# EAGLE design efm8ub1-kalypso-mezzanine-usb-interface-v1 (EAGLE 7.7.0)
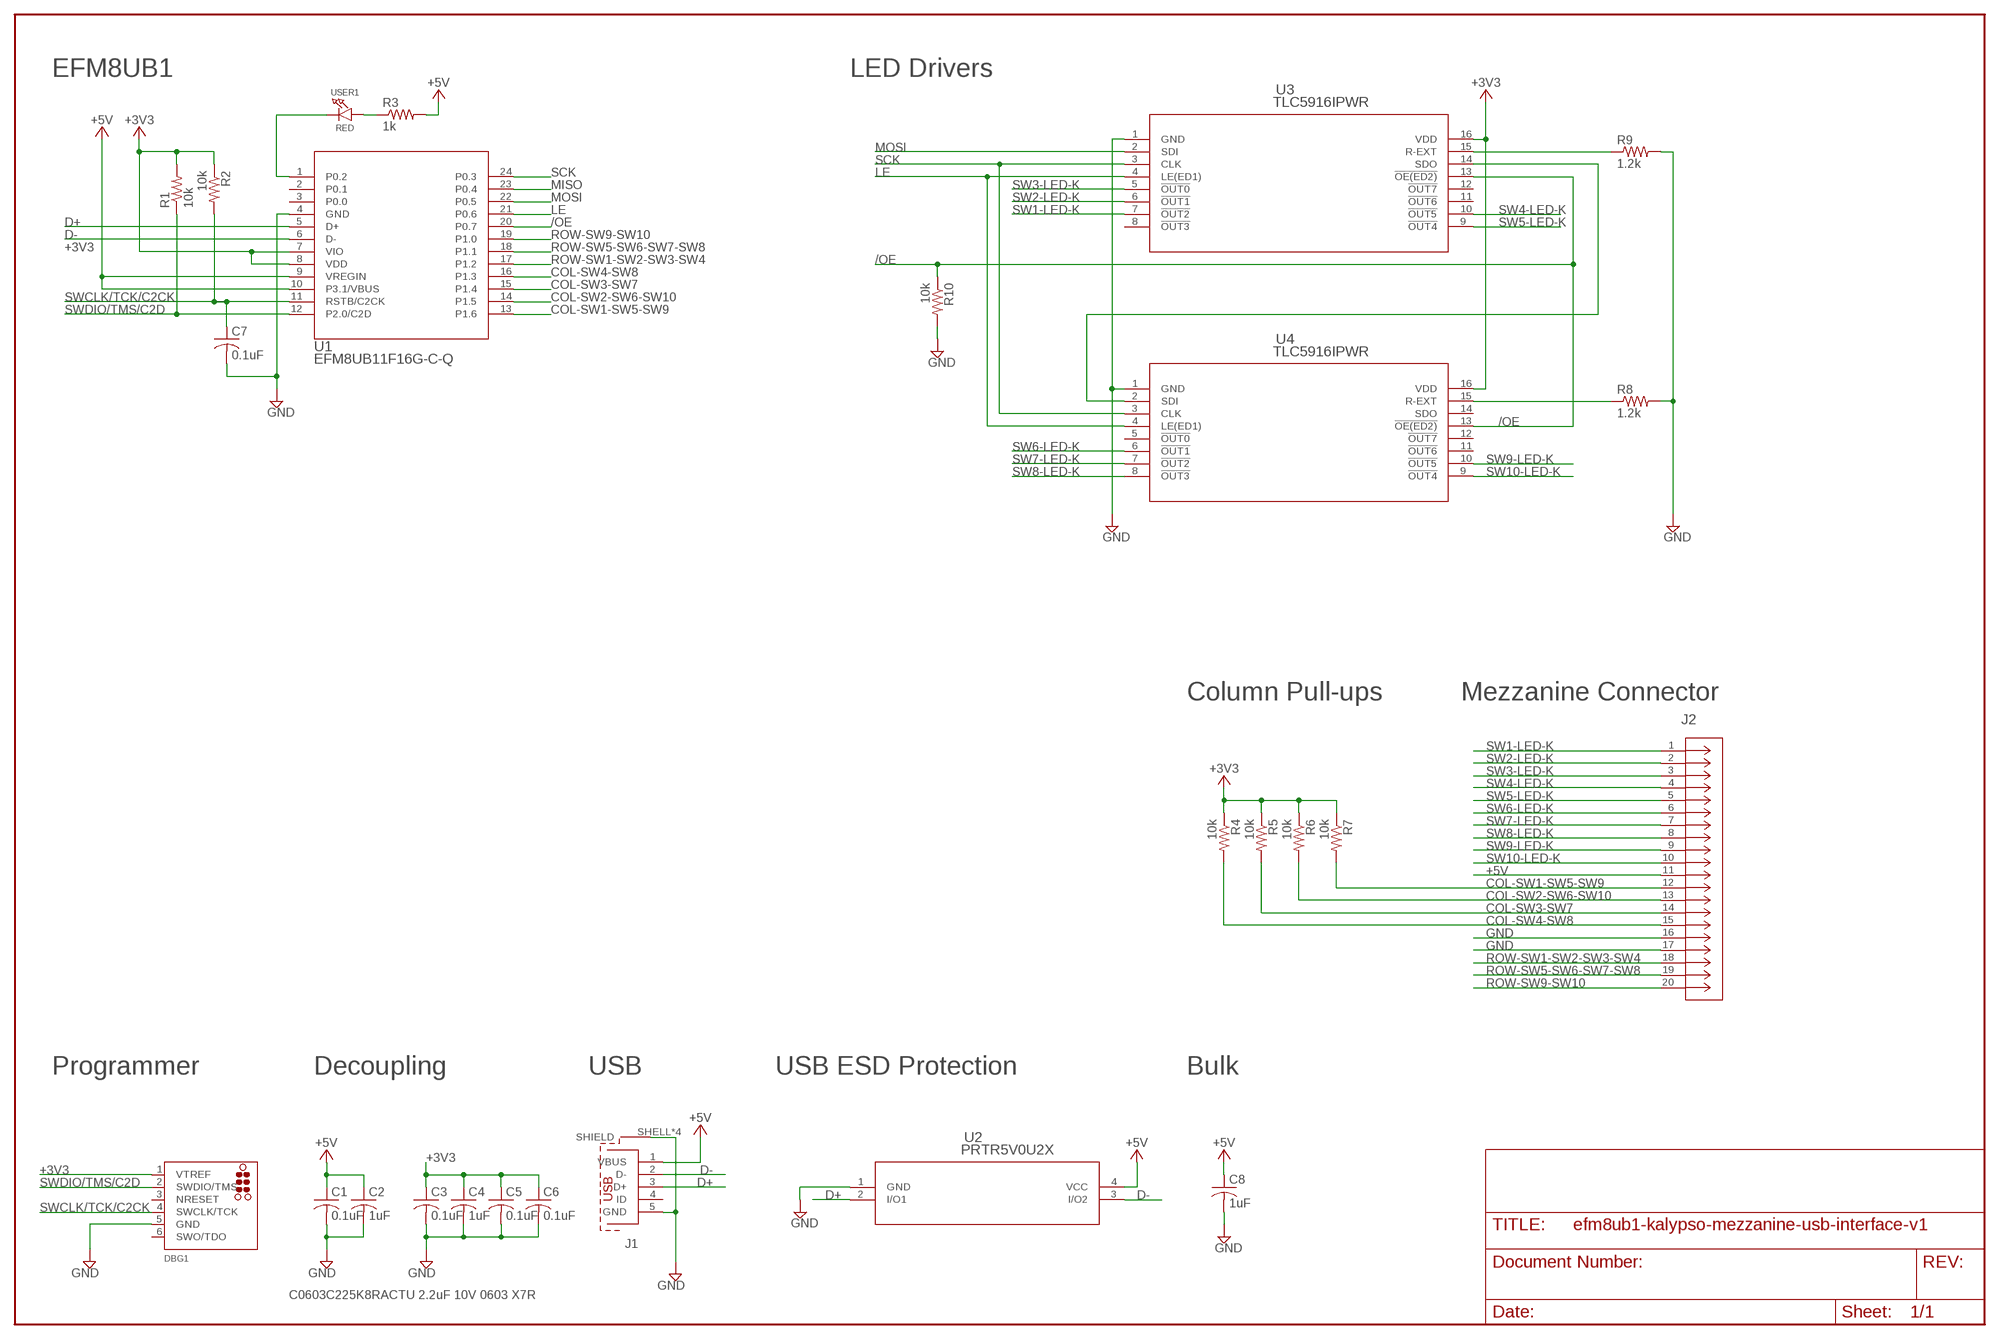
[diagram p0: schematic, sheet 1]

## Parts
C1  0.1uF  C-USC0603  [C0603]
C2  1uF  C-USC0603  [C0603]
C3  0.1uF  C-USC0603  [C0603]
C4  1uF  C-USC0603  [C0603]
C5  0.1uF  C-USC0603  [C0603]
C6  0.1uF  C-USC0603  [C0603]
C7  0.1uF  C-USC0603  [C0603]
C8  1uF  C-USC1210  [C1210]
DBG1  TC2030-CTX-SWD  [TC2030-MCP-NL]
J1  629105136821  [629105136821]
J2  SLW20S-1C7LF  [CON20_1X20_UB_58JF_GLE]
R1  10k  R-US_R0603  [R0603]
R2  10k  R-US_R0603  [R0603]
R3  1k  R-US_R0603  [R0603]
R4  10k  R-US_R0603  [R0603]
R5  10k  R-US_R0603  [R0603]
R6  10k  R-US_R0603  [R0603]
R7  10k  R-US_R0603  [R0603]
R8  1.2k  R-US_R0603  [R0603]
R9  1.2k  R-US_R0603  [R0603]
R10  10k  R-US_R0603  [R0603]
U1  EFM8UB11F16G-C-Q  [QSOP24]
U2  PRTR5V0U2X  [SOT143B]
U3  TLC5916IPWR  [PW16_TEX]
U4  TLC5916IPWR  [PW16_TEX]
USER1  RED  LED0805_NOOUTLINE  [CHIPLED_0805_NOOUTLINE]

## Nets
+3V3: C3.1 C4.1 C5.1 C6.1 DBG1.1(VTREF) R1.2 R2.1 R4.1 R5.1 R6.1 R7.1 U1.7(VIO) U1.8(VDD) U3.16(VDD) U4.16(VDD)
+5V: C1.1 C2.1 C8.1 J1.1(VBUS) J2.11 R3.2 U1.9(VREGIN) U1.10(P3.1/VBUS) U2.4(VCC)
/OE: R10.1 U1.20(P0.7) U3.13(!OE(ED2)) U4.13(!OE(ED2))
COL-SW1-SW5-SW9: J2.12 R7.2 U1.13(P1.6)
COL-SW2-SW6-SW10: J2.13 R6.2 U1.14(P1.5)
COL-SW3-SW7: J2.14 R5.2 U1.15(P1.4)
COL-SW4-SW8: J2.15 R4.2 U1.16(P1.3)
D+: J1.3(D+) U1.5(D+) U2.2(I/O1)
D-: J1.2(D-) U1.6(D-) U2.3(I/O2)
GND: C1.2 C2.2 C3.2 C4.2 C5.2 C6.2 C7.2 C8.2 DBG1.5(GND) J1.5(GND) J1.SHELL1(SHIELD) J1.SHELL2(SHIELD) J1.SHELL3(SHIELD) J1.SHELL(SHIELD) J2.16 J2.17 R8.2 R9.2 R10.2 U1.4(GND) U2.1(GND) U3.1(GND) U4.1(GND)
LE: U1.21(P0.6) U3.4(LE(ED1)) U4.4(LE(ED1))
MISO: U1.23(P0.4)
MOSI: U1.22(P0.5) U3.2(SDI)
N$2: R3.1 USER1.A
N$3: U3.14(SDO) U4.2(SDI)
N$4: R8.1 U4.15(R-EXT)
N$5: R9.1 U3.15(R-EXT)
ROW-SW1-SW2-SW3-SW4: J2.18 U1.17(P1.2)
ROW-SW5-SW6-SW7-SW8: J2.19 U1.18(P1.1)
ROW-SW9-SW10: J2.20 U1.19(P1.0)
SCK: U1.24(P0.3) U3.3(CLK) U4.3(CLK)
SW1-LED-K: J2.1 U3.7(!OUT2)
SW2-LED-K: J2.2 U3.6(!OUT1)
SW3-LED-K: J2.3 U3.5(!OUT0)
SW4-LED-K: J2.4 U3.10(!OUT5)
SW5-LED-K: J2.5 U3.9(!OUT4)
SW6-LED-K: J2.6 U4.6(!OUT1)
SW7-LED-K: J2.7 U4.7(!OUT2)
SW8-LED-K: J2.8 U4.8(!OUT3)
SW9-LED-K: J2.9 U4.10(!OUT5)
SW10-LED-K: J2.10 U4.9(!OUT4)
SWCLK/TCK/C2CK: C7.1 DBG1.4(SWCLK/TCK) R2.2 U1.11(RSTB/C2CK)
SWDIO/TMS/C2D: DBG1.2(SWDIO/TMS) R1.1 U1.12(P2.0/C2D)
USER1: U1.1(P0.2) USER1.C
Unconnected: DBG1.6(SWO/TDO) J1.4(ID) U1.2(P0.1) U1.3(P0.0) U3.8(!OUT3) U3.11(!OUT6) U3.12(!OUT7) U4.5(!OUT0) U4.11(!OUT6) U4.12(!OUT7) U4.14(SDO)

## Notes on the sheet
- EFM8UB1 | LED Drivers
- Column Pull-ups | Mezzanine Connector
- Programmer | Decoupling | USB | USB ESD Protection | Bulk
- C0603C225K8RACTU 2.2uF 10V 0603 X7R

## Power pins joined to a net without a drawn wire
NRESET: DBG1.3(NRESET)

## Library data of the parts
C1-C8 = rcl:C-US: CAPACITOR, American symbol
DBG1 = tag-connect:TC2030-CTX-SWD
J1 = InputOutputIO (rev18a):629105136821: WR-COM SMT Horizontal 5 Contacts Micro USB Type B,5 pins=>Code : Con_I-O_COM_MicroUSB_629105136821 <http://katalog.we-online.de/media/images/eican/Con_I-O_COM_MicroUSB_629105136821_pf2.jpg> Details see: http://katalog.we-online.de/en/em/COM_MICRO_SMT_TYPE_B_HORIZONTAL/629105136821?m Created 2014-07-09, Karrer Zheng 2014 (C) Würth Elektronik
J2 = SLW20S-1C7LF:SLW20S-1C7LF; BUILT_BY: EMA_UL_Team; MANUFACTURER_PART_NUMBER: SLW20S-1C7LF; SOURCELIBRARY: Glenair_2008-01-01_3; VENDOR: FCI
R1-R10 = rcl:R-US_: RESISTOR, American symbol
U1 = EFM8UB11F16G-C-QSOP24:EFM8UB11F16G-C-Q; MANUFACTURER_PART_NUMBER: efm8ub11f16gbqsop24; VENDOR: Silicon Labs
U2 = Nexperia_PRTR5V0U2X,215:PRTR5V0U2X; MANUFACTURER_PART_NUMBER: PRTR5V0U2X; VENDOR: NXP
U3 U4 = ul_tlc5916:TLC5916IPWR; BUILT_BY: EMA_UL_Team; MANUFACTURER: Texas Instruments; MANUFACTURER_PART_NUMBER: TLC5916IPWR; SOURCELIBRARY: TI_2015-1-6; VENDOR: Texas Instruments
USER1 = microbuilder:LED: LED 0603 - 0603 Surface Mount Package 2mA: Green LED - Low Power (3.9mcd, 2ma, 1.7Vf) - Digikey: 475-2709-2-ND Orange LED - Low Power (9.8mcd, 2ma, 1.8Vf) - Digikey: 475-1194-2-ND Red LED - Low Power (5mcd, 2ma, 1.8Vf) - Digikey: 475-1195-2-ND Yellow LED - Low Power (7mcd, 2ma, 1.8Vf) - Digikey: 475-1196-2-ND 5mA: Blue LED - Low Power (17mcd, 5ma, 2.9Vf) - Digikey: LNJ937W8CRACT-ND 0805 - 0805 Surface Mount Package 2mA: Red LED (8.8mcd, 2mA, 1.8Vf, Clear) - Low Power [Digikey: 475-2510-1-ND] Green LED (5mcd, 2mA, 1.8Vf, Clear) - Low Power [Digikey: 475-2730-1-ND] Yellow LED (11.3mcd, 2mA, 1.8Vf, Clear) - Low Power [Digikey: 475-2555-1-ND] 20mA: Red LED (104mcd, 20mA, Diffused) - LS R976 [Digikey: 475-1278-6-ND] Red LED (12mcd, 20mA, 2.0Vf, Clear) - APT2012EC [Digikey: 754-1128-1-ND] Green LED (15mcd, 20mA, 2.2Vf, Clear) - APT2012GC [Digikey: 754-1131-1-ND] Orange LED (160mcd, 20mA, 2.1Vf, Clear) - APT2012SECK [Digikey: 754-1130-1-ND] 1206 - 1206 Surface Mount Package Green LED (26mcd, 20mA, Diffused) - LG N971 [Digikey: 475-1407-6-ND] Red LED (15mcd, 20mA, Diffused) - LH N974 [Digikey: 475-1416-6-ND] Cree - Cree High-Power Surface Mount LEDs XPEBWT-L1-0000-00D50 - White 111lm 350mA 2.9Vf 6200K 110° XTEAWT-00-0000-00000LEE3 - White 114lm 350mA 2.85Vf 5000K 115° Everlight - Everlight 45-21 Series Surface Mount LEDs 45-21/QK2C-B2832AC2CB2/2T - Warm White 2000mcd 20mA 3.25Vf 3050K 120° 45-21/LK2C-B38452C4CB2/2T - Nuetral White 2000mcd 20mA 3.25Vf 4150K 120° 45-21/LK2C-B50634C6CB2/2T - Cold White 2200mcd 20mA 3.25Vf 5650K 120° PLCC2 Reverse Mount LS T77K-J1L2-1-0-2-R18-Z - Red 11.25mcd 2mA 1.8Vf 630nm 120° LO T77K-L1M2-24-Z - Orange 19.6mcd 2mA 1.8Vf 606nm 120° LY T77K-K2M1-26-Z - Yellow 15.7mcd 2mA 1.8Vf 587nm 120°

## Board
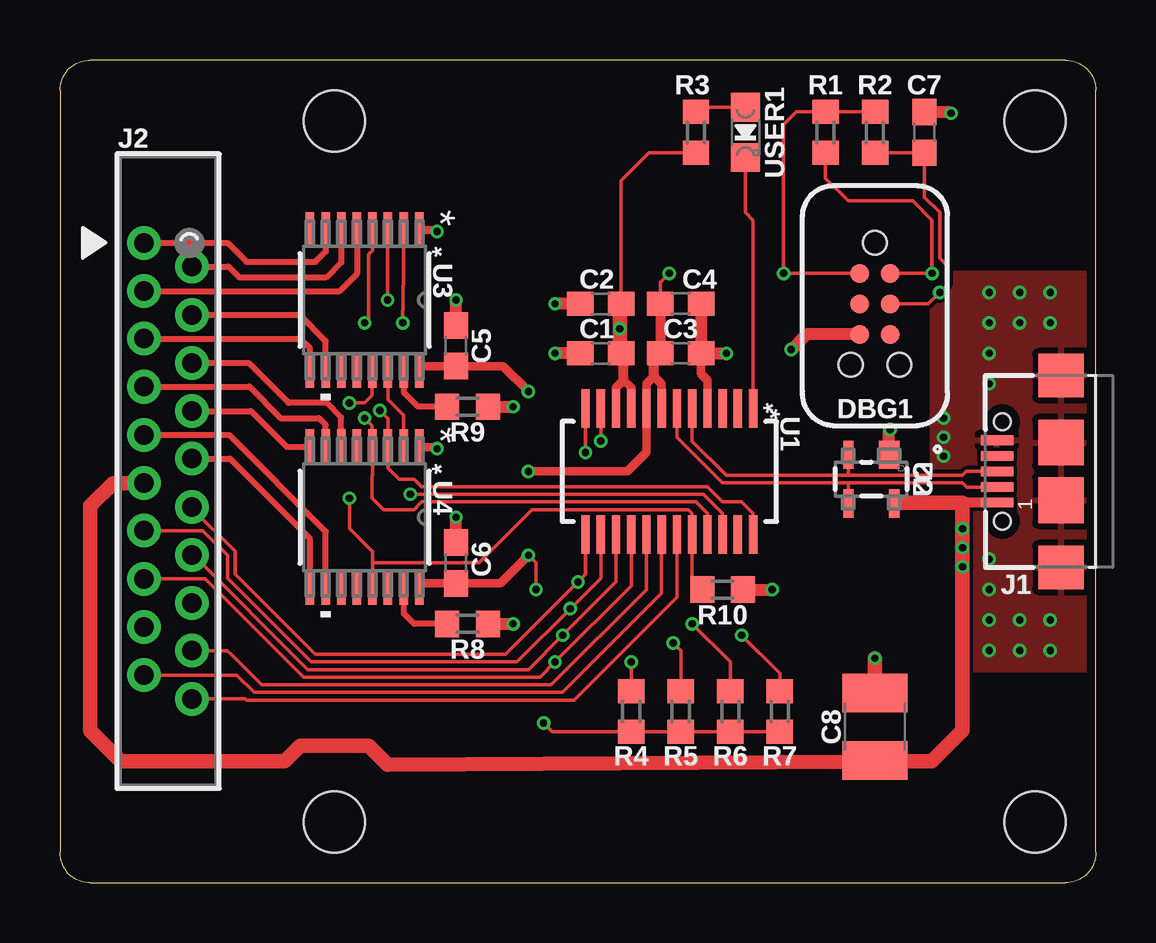
[diagram p1: board, top side]
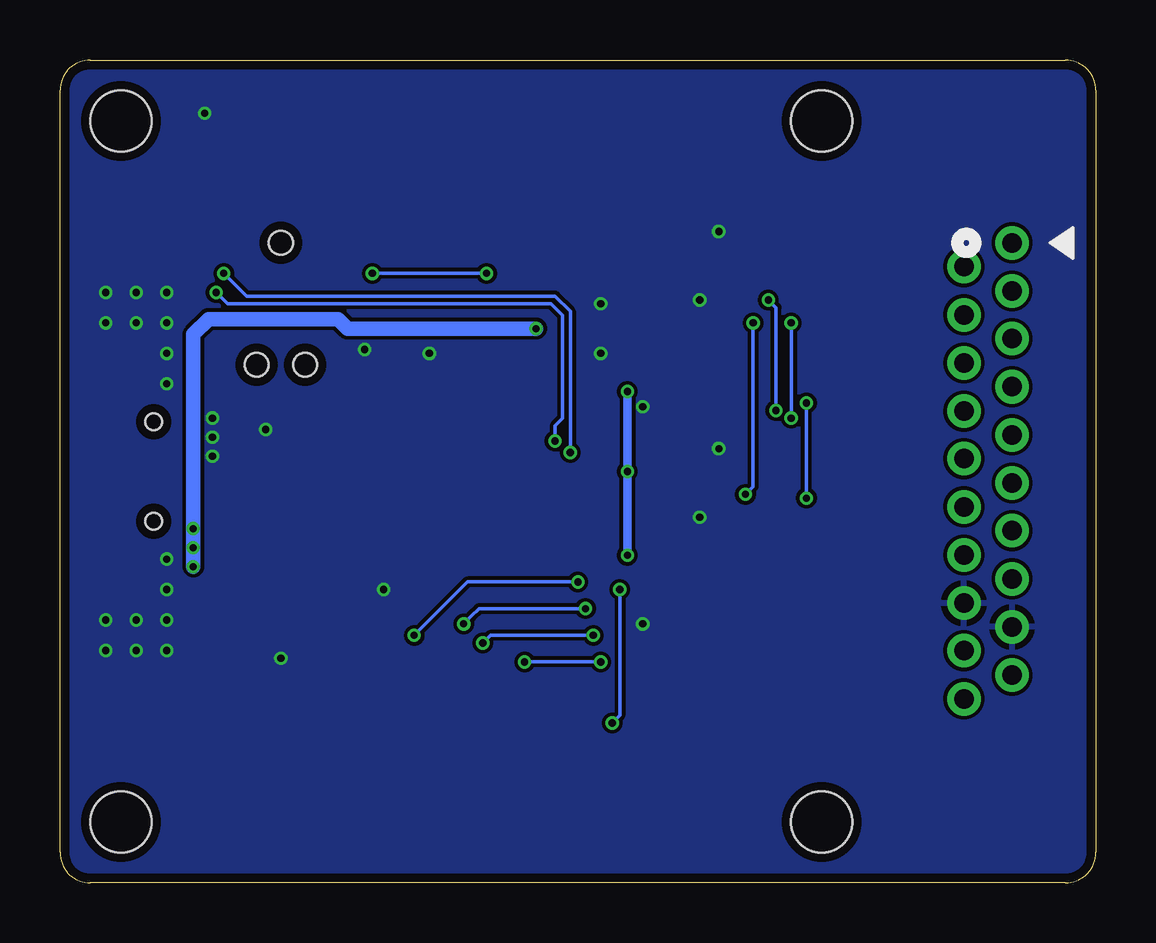
[diagram p2: board, bottom side, seen from below]

Size 43.18 x 34.29 mm. Coordinates in mm from the lower left corner, seen from the top.
Outline: 1.27,0 41.91,0 arc90 43.18,1.27 43.18,33.02 arc90 41.91,34.29 1.27,34.29 arc90 0,33.02 0,1.27 arc90 1.27,0
Copper layers (1*16): Top 0.035559375mm / dielectric 1.6mm / Bottom 0.035559375mm
Design rules "oshpark-2layer-2018": minimum track width 6mil, minimum drill 10mil, track to track 6mil, track to pad 6mil, pad to pad 6mil, via to via 6mil, smd to smd 6mil, copper to edge 15mil, drill to drill 6mil, minimum pad ring 5mil, minimum via ring 5mil, stop-mask expansion 2.5mil, vias tented up to drill 0mil, thermal gap 10mil
Holes 2.54 mm at 11.43,31.75 40.64,31.75 40.64,2.54 11.43,2.54
tKeepout: area 8.9,29.8 to 13.4,34.3; area 8.9,0 to 13.4,4.5; area 38.7,0 to 43.2,4.5; area 38.7,29.8 to 43.2,34.3
bKeepout: area 38.1,29.2 to 43.2,34.3; area 38.1,0 to 43.2,5.1; area 8.9,0 to 14,5.1; area 8.9,29.2 to 14,34.3; area 8.6,29 to 14.2,34.5; area 37.8,29 to 43.4,34.5; area 37.8,-0.3 to 43.4,5.3; area 8.6,-0.3 to 14.2,5.3

### Footprints (pad centres in the part's own frame; a part is rotated, then mirrored left to right if it is on the bottom)
C0603 = smd 1.1 x 1: 1 -0.85,0; 2 0.85,0
C1210 = smd 1.6 x 2.7: 1 -1.4,0; 2 1.4,0
TC2030-MCP-NL = smd 0.787 x 0.787: 1 1.27,-0.635; 2 1.27,0.635; 3 2.54,-0.635; 4 2.54,0.635; 5 3.81,-0.635; 6 3.81,0.635 | hole 0.991: 0,0; 5.08,-1.016; 5.08,1.016
629105136821 = smd 0.4 x 1.35: 1 -1.3,2.675; 2 -0.65,2.675; 3 0,2.675; 4 0.65,2.675; 5 1.3,2.675 | smd 1.8 x 1.9: SHELL -4,0; SHELL3 4,0 | smd 1.9 x 1.9: SHELL1 -1.2,0; SHELL2 1.2,0 | hole 0.7: -2.075,2.45; 2.075,2.45
CON20_1X20_UB_58JF_GLE = drill 0.813 pad 1.397: 1 0,0; 2 0.991,2.007; 3 2.007,0; 4 2.997,2.007; 5 3.988,0; 6 5.004,2.007; 7 5.994,0; 8 7.01,2.007; 9 8.001,0; 10 8.992,2.007; 11 10.008,0; 12 10.998,2.007; 13 11.989,0; 14 13.005,2.007; 15 13.995,0; 16 15.011,2.007; 17 16.002,0; 18 16.993,2.007; 19 18.009,0; 20 18.999,2.007
R0603 = smd 1 x 1.1: 1 -0.85,0; 2 0.85,0
QSOP24 = smd 1.6 x 0.35: 1 -2.625,3.493; 2 -2.625,2.857; 3 -2.625,2.223; 4 -2.625,1.587; 5 -2.625,0.953; 6 -2.625,0.318; 7 -2.625,-0.318; 8 -2.625,-0.953; 9 -2.625,-1.587; 10 -2.625,-2.223; 11 -2.625,-2.857; 12 -2.625,-3.493; 13 2.625,-3.493; 14 2.625,-2.857; 15 2.625,-2.223; 16 2.625,-1.587; 17 2.625,-0.953; 18 2.625,-0.318; 19 2.625,0.318; 20 2.625,0.953; 21 2.625,1.587; 22 2.625,2.223; 23 2.625,2.857; 24 2.625,3.493
SOT143B = smd 0.838 x 1.168: 1 -0.747,-1.016 | smd 0.432 x 1.168: 2 0.95,-1.016; 3 0.95,1.016; 4 -0.95,1.016
PW16_TEX = smd 1.473 x 0.356: 1 -2.921,2.275; 2 -2.921,1.625; 3 -2.921,0.975; 4 -2.921,0.325; 5 -2.921,-0.325; 6 -2.921,-0.975; 7 -2.921,-1.625; 8 -2.921,-2.275; 9 2.921,-2.275; 10 2.921,-1.625; 11 2.921,-0.975; 12 2.921,-0.325; 13 2.921,0.325; 14 2.921,0.975; 15 2.921,1.625; 16 2.921,2.275
CHIPLED_0805_NOOUTLINE = smd 1.2 x 1.2: A 0,-1.05; C 0,1.05

### Placement (x,y rotation side)
C1  22.54,22.07 180 top
C2  22.54,24.13 180 top
C3  25.88,22.07 0 top
C4  25.88,24.13 0 top
C5  16.51,22.38 90 top
C6  16.51,13.34 90 top
C7  36.04,31.27 90 top
C8  33.97,6.51 90 top
DBG1  33.97,26.67 270 top
J1  41.73,17.14 90 top
J2  3.49,26.67 270 top
R1  31.91,31.27 90 top
R2  33.97,31.27 270 top
R3  26.51,31.27 270 top
R4  23.81,7.14 90 top
R5  25.88,7.14 90 top
R6  27.94,7.14 90 top
R7  30,7.14 90 top
R8  16.99,10.79 0 top
R9  16.99,19.84 0 top
R10  27.62,12.22 0 top
U1  25.4,17.14 270 top
U2  33.81,16.83 180 top
U3  12.7,24.29 270 top
U4  12.7,15.24 270 top
USER1  28.57,31.27 180 top

### Tracks (layer width: path | path; a pad name or v marks a point on that pad's centre or on a via)
+3V3  (via drill 0.3)
  Top 0.152: R2.1 R1.2 30.7,32.12 30.16,31.59 v30.16,25.4 DBG1.1 | C4.1 25.03,25.03 v25.4,25.4 | 15.14,21.53 U3.16 | 15.14,12.48 U4.16 | R7.1 R6.1 R5.1 R4.1 20.54,6.29 v20.16,6.67 20.48,6.35 | v19.84,12.22 19.84,13.34 v19.53,13.65
  Top 0.356: 15.14,21.53 C5.1 18.47,21.53 v19.53,20.48 | 15.14,12.48 C6.1 18.36,12.48 v19.53,13.65 | v19.53,17.14 23.65,17.14 24.45,17.94 U1.8 24.45,20.8 24.77,21.11 25.08,20.8 U1.7
  Top 0.406: 24.77,21.11 24.77,22.01 C3.1 C4.1
  Bottom 0.152: v25.4,25.4 v30.16,25.4 | v19.84,12.22 19.84,6.99 v20.16,6.67
  Bottom 0.356: v19.53,20.48 v19.53,17.14 v19.53,13.65
+5V  (via drill 0.3)
  Top 0.152: 37.47,13.34 v37.62,13.18 | R3.2 24.55,30.42 23.39,29.27 C2.1
  Top 0.356: U1.9 23.81,20.64 23.5,20.95 23.18,20.64 U1.10 | 23.5,21.96 C1.1
  Top 0.406: 23.5,20.95 23.5,21.96 | 23.34,24.07 C2.1 | 23.34,22.12 C1.1 | J1.1 37.62,15.85 | 34.8,15.85 U2.4
  Top 0.61: 23.34,24.07 v23.34,23.1 23.34,22.12 | 34.8,15.85 37.62,15.85 v37.62,14.76 v37.62,13.97 v37.62,13.18 37.62,6.35 36.35,5.08 | J2.11 2.22,16.66 1.27,15.72 1.27,6.35 2.54,5.08 9.37,5.08 10,5.71 12.86,5.71 13.65,4.92 36.35,5.08 | 36.35,5.08 34,5.08 C8.1
  Bottom 0.61: v23.34,23.1 31.2,23.1 31.59,23.5 36.99,23.5 37.62,22.86 v37.62,14.76 v37.62,13.97 v37.62,13.18
/OE  (via drill 0.3)
  Top 0.152: U4.13 13.03,13.34 | 13.03,13.34 13.03,13.8 | 13.03,13.81 13.03,13.8 | 13.03,13.8 12.06,14.76 v12.06,16.03 | v12.06,20 12.7,20 13.02,20.32 U3.13 | 13.03,13.34 17.46,13.34 19.68,15.56 26.19,15.56 26.35,15.4 U1.20 26.35,12.64 R10.1
  Bottom 0.152: v12.06,16.03 v12.06,20
COL-SW1-SW5-SW9  (via drill 0.3)
  Top 0.152: J2.12 5.5,15.62 7.3,13.81 7.3,12.86 10.64,9.53 18.57,9.53 v21.59,12.54 21.91,12.86 U1.13 | R7.2 30,8.73 v28.42,10.32
  Bottom 0.152: v28.42,10.32 26.19,12.54 v21.59,12.54
COL-SW2-SW6-SW10  (via drill 0.3)
  Top 0.152: J2.13 5.96,14.68 6.99,13.65 6.99,12.7 10.48,9.21 19.05,9.21 v21.27,11.43 22.54,12.7 U1.14 | R6.2 27.94,9.21 v26.35,10.79
  Bottom 0.152: v21.27,11.43 25.72,11.43 26.04,11.11 v26.35,10.79
COL-SW3-SW7  (via drill 0.3)
  Top 0.152: J2.14 5.54,13.66 10.32,8.89 19.53,8.89 v20.95,10.32 23.18,12.54 U1.15 | R5.2 25.88,9.68 v25.56,10
  Bottom 0.152: v20.95,10.32 25.24,10.32 25.4,10.16 v25.56,10
COL-SW4-SW8  (via drill 0.3)
  Top 0.152: J2.15 6.06,12.68 10.16,8.57 20,8.57 v20.64,9.21 23.81,12.38 U1.16 | R4.2 v23.81,9.21
  Bottom 0.152: v20.64,9.21 v23.81,9.21
D+
  Top 0.152: J1.3 37.78,17.14 37.62,16.99 32.86,16.99 | U2.2 32.86,16.99 | U1.5 26.35,18.41 27.78,16.99 32.86,16.99
D-
  Top 0.152: J1.2 37.8,16.5 37.62,16.67 32.86,16.67 | U2.3 32.86,16.67 | U1.6 25.72,18.57 27.62,16.67 32.86,16.67
GND  (via drill 0.3)
  Top 0.356: U1.4 26.99,20.95 26.73,21.22 C3.2 | U3.1 15.61,27.2 v15.72,27.15 | U4.1 15.65,18.16 v15.72,18.1
  Top 0.508: C4.2 C3.2 v27.78,22.07 | C1.2 v20.64,22.07 | C2.2 v20.64,24.13 | C7.2 37.09,32.12 v37.15,32.07 | DBG1.5 31.11,22.86 v30.48,22.23 | U2.1 34.56,18.84 v34.61,18.89 | R9.2 v18.89,19.84 | R8.2 v18.89,10.79 | C5.2 v16.51,24.29 | C6.2 v16.51,15.24 | R10.2 v29.69,12.22
  Top 0.61: C8.2 v33.97,9.37
  other vias: 38.73,24.61 40.01,24.61 41.27,24.61 41.27,23.34 40.01,23.34 38.73,23.34 38.73,22.07 41.27,10.95 41.27,9.68 40.01,9.68 40.01,10.95 38.73,10.95 38.73,9.68 38.73,12.22 38.73,20.8 38.73,13.49 36.83,17.78 36.83,18.57 36.83,19.37
  pour Bottom (isolate 0.152): 0,34.29 0,0 43.18,0 43.18,34.29
  pour Top (isolate 0.152): 36.35,25.4 36.35,8.89 43.18,8.89 43.18,25.4
LE  (via drill 0.3)
  Top 0.152: v12.7,19.37 13.02,19.05 U4.4 13.03,16.98 13.02,16.97 13.02,16.03 13.49,15.56 14.76,15.56 15.08,15.88 26.51,15.88 26.99,15.4 U1.21 | U3.4 13.03,26.36 12.86,26.19 12.86,23.5 v12.7,23.34
  Bottom 0.152: v12.7,23.34 v12.7,19.37
MOSI  (via drill 0.3)
  Top 0.152: U1.22 27.62,15.4 26.83,16.19 v14.61,16.19 | U3.2 14.32,25.44 v14.29,23.34
  Bottom 0.152: v14.29,23.34 14.29,16.51 v14.61,16.19
N$2
  Top 0.152: USER1.A 26.71,32.32 R3.1
N$3
  Top 0.152: U3.14 13.68,20.14 14.32,19.49 U4.2
N$4
  Top 0.254: R8.1 14.76,10.79 14.32,11.23 U4.15
N$5
  Top 0.254: R9.1 14.92,19.84 14.32,20.44 U3.15
ROW-SW1-SW2-SW3-SW4
  Top 0.152: U1.17 24.45,12.22 20.48,8.26 8.41,8.26 7.14,9.53 6.98,9.68 J2.18
ROW-SW5-SW6-SW7-SW8
  Top 0.152: U1.18 25.08,12.06 20.95,7.94 8.1,7.94 7.37,8.66 J2.19
ROW-SW9-SW10
  Top 0.152: U1.19 25.72,11.91 21.43,7.62 7.78,7.62 7.73,7.67 J2.20
SCK  (via drill 0.3)
  Top 0.152: v13.34,19.68 13.68,19.34 U4.3 13.68,17.28 14.13,16.83 14.76,16.83 15.08,16.51 26.99,16.51 27.62,15.88 28.42,15.88 28.89,15.4 U1.24 | v13.65,24.29 13.65,27.19 U3.3
  Bottom 0.152: v13.34,19.68 13.34,23.97 v13.65,24.29
SW1-LED-K
  Top 0.254: J2.1 6.99,26.67 7.78,25.88 10.64,25.88 11.07,26.32 U3.7
SW2-LED-K
  Top 0.254: J2.2 7.02,25.68 7.46,25.24 11.11,25.24 11.72,25.85 U3.6
SW3-LED-K
  Top 0.254: J2.3 11.65,24.66 12.38,25.39 U3.5
SW4-LED-K
  Top 0.254: J2.4 9.98,23.67 11.07,22.58 U3.10
SW5-LED-K
  Top 0.254: J2.5 10.02,22.68 10.43,22.28 U3.9
SW6-LED-K
  Top 0.254: U4.6 11.72,19.39 11.11,20 9.53,20 7.86,21.67 J2.6
SW7-LED-K
  Top 0.254: J2.7 7.9,20.68 9.21,19.37 10.79,19.37 11.07,19.09 U4.7
SW8-LED-K
  Top 0.254: J2.8 7.96,19.66 9.46,18.16 U4.8
SW9-LED-K
  Top 0.254: J2.9 7.05,18.67 11.07,14.64 U4.10
SW10-LED-K
  Top 0.254: J2.10 7.09,17.68 10.43,14.34 U4.9
SWCLK/TCK/C2CK  (via drill 0.3)
  Top 0.152: v22.54,18.41 U1.11 | DBG1.4 36.2,24.13 v36.67,24.61 36.99,24.92 36.99,25.72 36.67,26.04 36.67,27.94 36.04,28.57 C7.1 R2.2
  Bottom 0.152: v22.54,18.41 22.54,19.05 22.23,19.37 22.23,23.65 22.7,24.13 36.2,24.13 v36.67,24.61
SWDIO/TMS/C2D  (via drill 0.3)
  Top 0.152: v21.91,17.94 U1.12 | DBG1.2 v36.35,25.4 36.35,27.62 35.56,28.42 32.86,28.42 31.91,29.37 R1.1
  Bottom 0.152: v21.91,17.94 21.91,23.81 22.54,24.45 35.4,24.45 v36.35,25.4
USER1
  Top 0.152: U1.1 28.89,27.62 28.57,27.94 USER1.C

### Text on the board
_tsilk: R3 | R1 | R2 | C7 | J2 | USER1 | U3 | * | C2 | C4 | C1 | C3 | C5 | * | R9 | U1 | DBG1 | U4 | * | U2 | C6 | J1 | R10 | R8 | C8 | R4 | R5 | R6 | R7